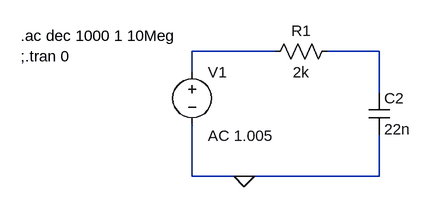
[diagram p0: schematic circuit2.asc]
circuit2.asc, the LTspice schematic file:
Version 4.1
SHEET 1 880 680
WIRE 128 96 0 96
WIRE 288 96 208 96
WIRE 0 128 0 96
WIRE 288 160 288 96
WIRE 0 288 0 208
WIRE 80 288 0 288
WIRE 288 288 288 224
WIRE 288 288 80 288
FLAG 80 288 0
SYMBOL voltage 0 112 R0
WINDOW 123 24 114 Left 2
WINDOW 39 0 0 Left 0
SYMATTR Value2 AC 1.005
SYMATTR InstName V1
SYMATTR Value ""
SYMBOL res 224 80 R90
WINDOW 0 0 56 VBottom 2
WINDOW 3 32 56 VTop 2
SYMATTR InstName R1
SYMATTR Value 2k
SYMBOL cap 272 160 R0
SYMATTR InstName C2
SYMATTR Value 22n
TEXT -264 72 Left 2 !.ac dec 1000 1 10Meg\n;.tran 0

The netlist it stands for:
* circuit2.asc
V1 N001 0 AC 1.005
R1 N002 N001 2k
C2 N002 0 22n
.ac dec 1000 1 10Meg
;.tran 0
.backanno
.end